# Altium project 无线调试版.PrjPCB
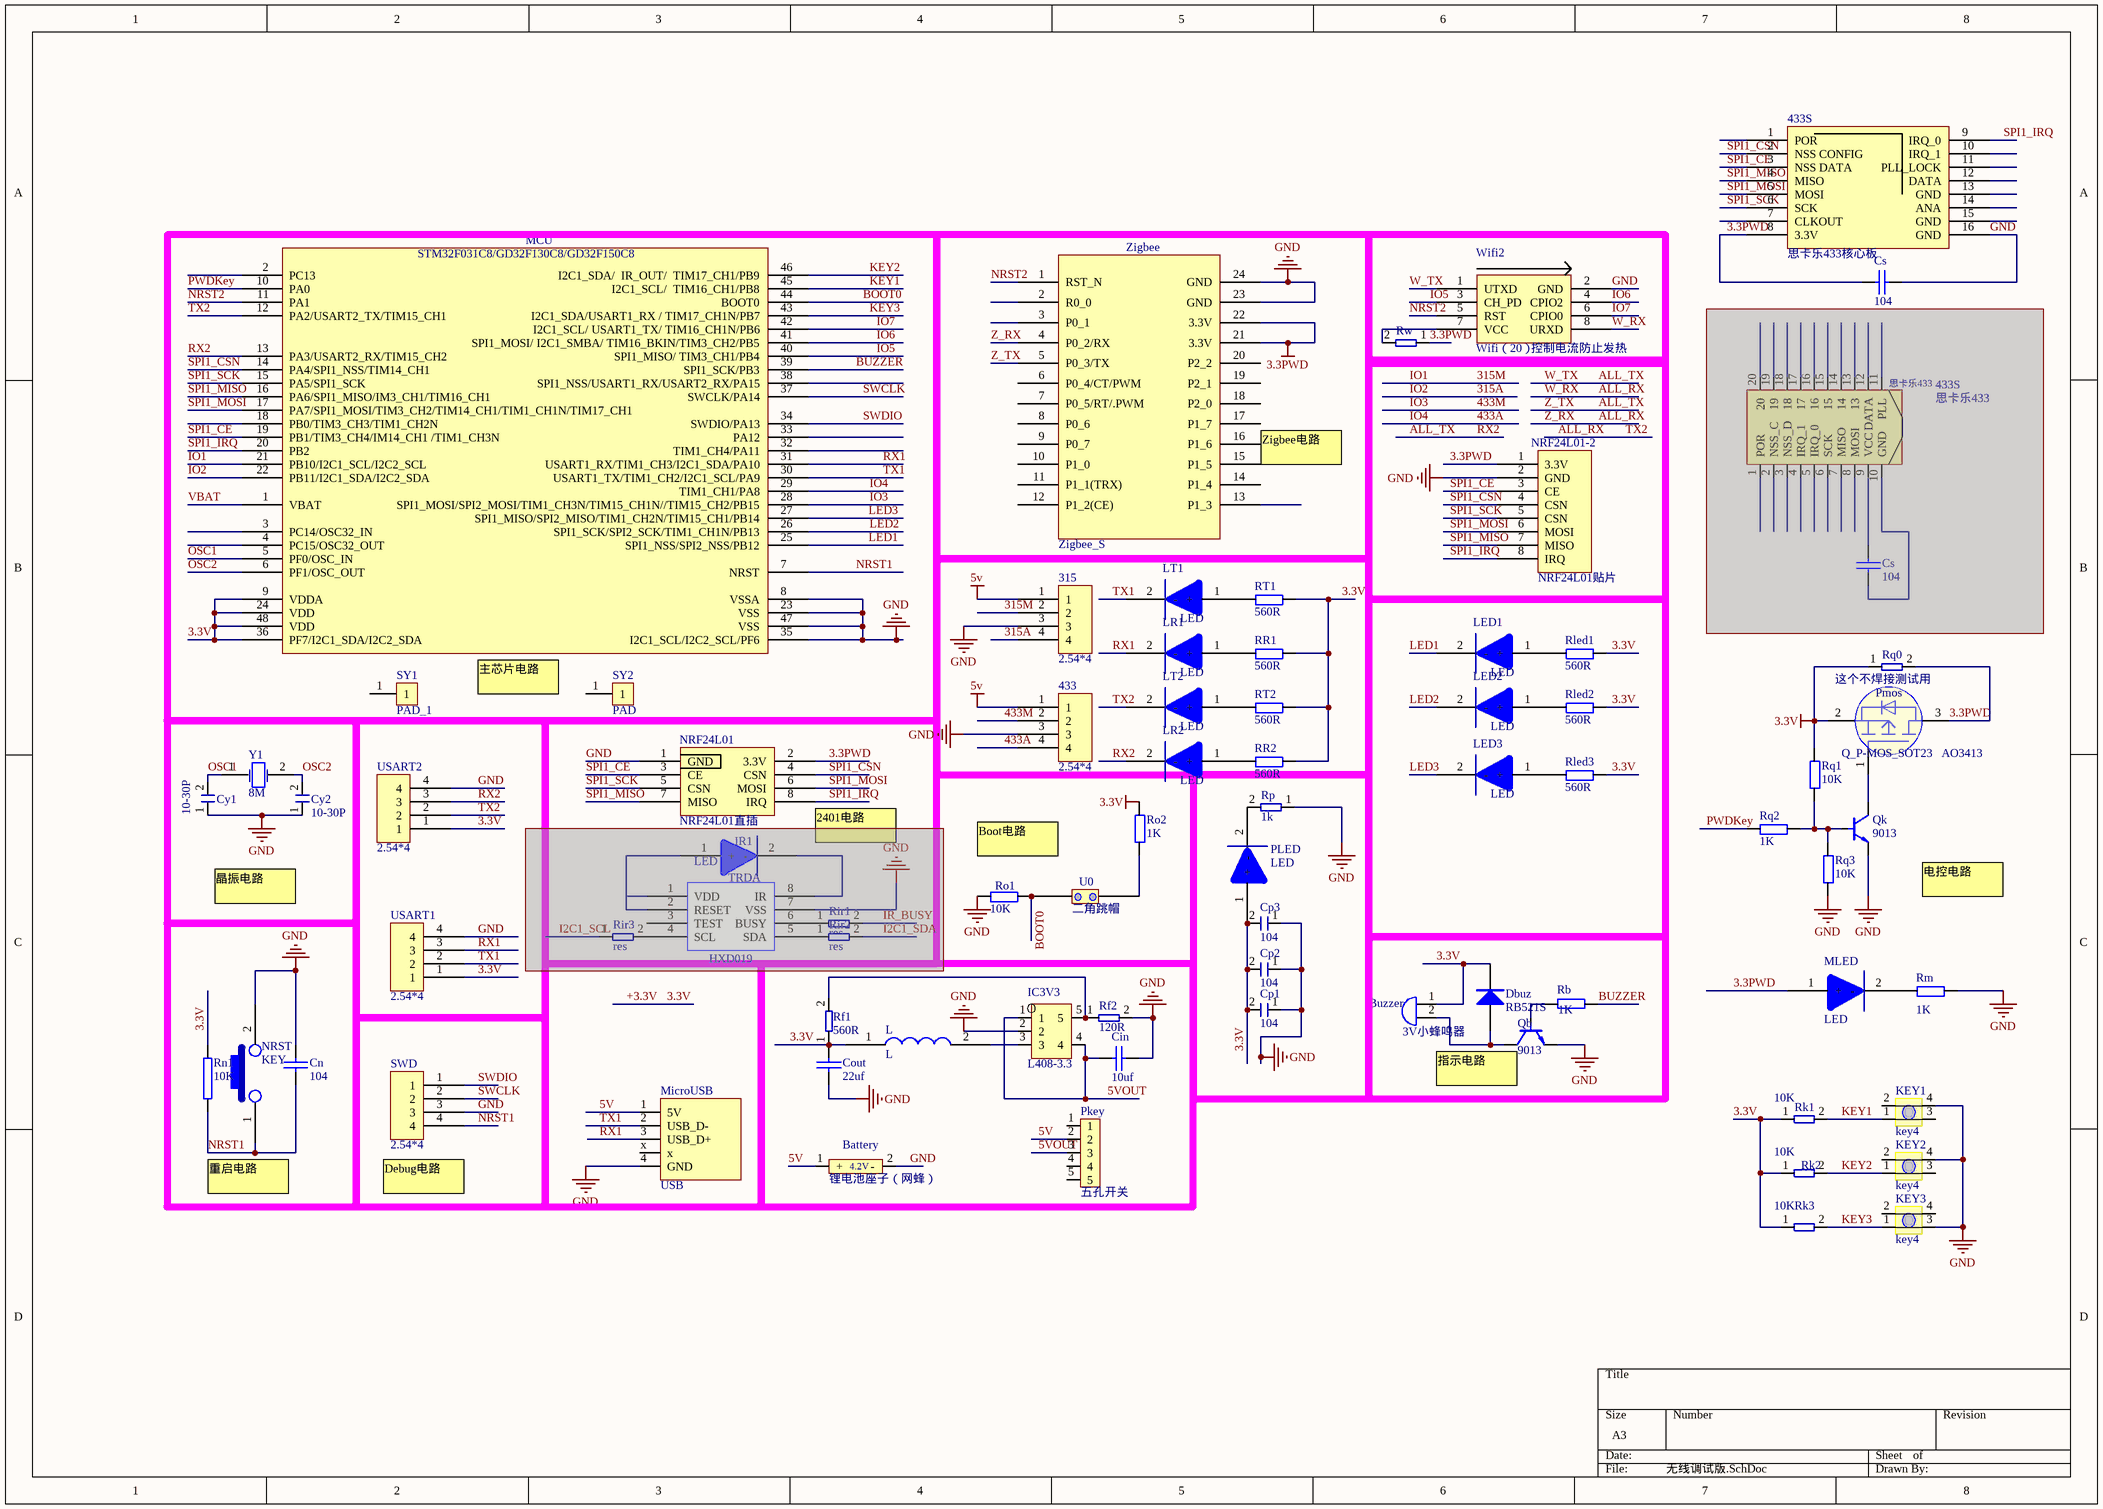
[diagram p0: 无线调试版.SchDoc]
1 sheet, 77 parts. Net scope: global (net labels, ports and power ports of the same name join across sheets).
Board file: 无线调试版.PcbDoc

## Sheet 无线调试版.SchDoc
size A3

### Parts
(Parts that share a designator on the sheet are numbered #1, #2 ... from top to bottom, then left to right.)
315  2.54*4  [2.54*4]
433  2.54*4  [2.54*4]
433S#1  思卡乐433核心板  [思卡乐433核心板]
433S#2  思卡乐433  [思卡乐433]  (masked out: inside a compile mask, not in the netlist)
Battery  锂电池座子（网蜂）  [锂电池插座（网蜂）]
Buzzer  3V小蜂鸣器  [3V小蜂鸣器]
Cin  10uf  [0805]
Cn  104  [0603]
Cout  22uf  [0805]
Cp1  104  [0603]
Cp2  104  [0603]
Cp3  104  [0603]
Cs#1  104  [0603A]
Cs#2  104  [0603A]  (masked out: inside a compile mask, not in the netlist)
Cy1  10-30P  [0603]
Cy2  10-30P  [0603]
Dbuz  RB521S  [贴片二极管]
IC3V3  L408-3.3  [SOT-23-5]
IR1  LED  [LED]  (masked out: inside a compile mask, not in the netlist)
KEY1  key4  [key4]
KEY2  key4  [key4]
KEY3  key4  [key4]
L  L  [774 2.2UH]
LED1  LED  [0805]
LED2  LED  [0805]
LED3  LED  [0805]
LR1  LED  [0805]
LR2  LED  [0805]
LT1  LED  [0805]
LT2  LED  [0805]
MCU  F0-MCU  [STM32F103C8]  (value not drawn)
MicroUSB  USB  [USB_Micro]
MLED  LED  [0805]
NRF24L01  NRF24L01直插  [NFR24L01直插]
NRF24L01-2  NRF24L01贴片  [nrf2401贴片]
NRST  KEY  [KEY]
Pkey  五孔开关  [五孔小开关]
PLED  LED  [0805]
Pmos  Q_P-MOS_SOT23   AO3413  [SOT23]
Qb  9013  [SOT23]
Qk  9013  [SOT23]
Rb  1K  [0603A]
Rf1  560R  [0603A]
Rf2  120R  [0603A]
Rir1  res  [0805]  (masked out: inside a compile mask, not in the netlist)
Rir2  res  [0603A]  (masked out: inside a compile mask, not in the netlist)
Rir3  res  [0603A]  (masked out: inside a compile mask, not in the netlist)
Rk1  10K  [0603A]
Rk2  10K  [0603A]
Rk3  10K  [0603A]
Rled1  560R  [0603A]
Rled2  560R  [0603A]
Rled3  560R  [0603A]
Rm  1K  [0603A]
Rn1  10K  [0603A]
Ro1  10K  [0603A]
Ro2  1K  [0603A]
Rp  1k  [0603A]
Rq0  这个不焊接测试用  [0603A]
Rq1  10K  [0603A]
Rq2  1K  [0603A]
Rq3  10K  [0603A]
RR1  560R  [0603A]
RR2  560R  [0603A]
RT1  560R  [0603A]
RT2  560R  [0603A]
Rw  控制电流防止发热  [0603A]
SWD  2.54*4  [2.54*4]
SY1  PAD_1  [HS]
SY2  PAD  [fc]
TRDA  HXD019  [SOP8]  (masked out: inside a compile mask, not in the netlist)
U0  二角跳帽  [二角跳帽]
USART1  2.54*4  [2.54*4]
USART2  2.54*4  [2.54*4]
Wifi2  Wifi（20）  [Wifi（20）]
Y1  8M  [Crystal]
Zigbee  Zigbee_S  [Zigebee_S]

### Nets
3.3PWD: 433S#1.8(3.3V) Cs#1.1 MLED.1(+) NRF24L01.2(3.3V) NRF24L01-2.1(3.3V) Pmos.3(D) Rq0.2 Rw.1 Zigbee.21(3.3V) Zigbee.22(3.3V)
5V: 315.1 433.1 Battery.1(+) MicroUSB.1(5V) Pkey.2
+3.3V: Buzzer.1(+) Cout.2 Cp1.2 Cp2.2 Cp3.2 Dbuz.K L.1 MCU.9(VDDA) MCU.24(VDD) MCU.36(PF7/I2C1_SDA/I2C2_SDA) MCU.48(VDD) PLED.1(+) Pmos.2(S) Rf1.1 Rk1.1 Rk2.1 Rk3.1 Rled1.2 Rled2.2 Rled3.2 Rn1.1 Ro2.2 Rq0.1 Rq1.2 RR1.2 RR2.2 RT1.2 RT2.2 USART1.1 USART2.1  [also labelled 3.3V]
GND: 315.3 433.3 433S#1.16(GND) Battery.2(-) Cin.2 Cn.2 Cout.1 Cp1.1 Cp2.1 Cp3.1 Cs#1.2 Cy1.1 Cy2.1 IC3V3.2 KEY1.4 KEY2.4 KEY3.3 MCU.8(VSSA) MCU.23(VSS) MCU.35(I2C1_SCL/I2C2_SCL/PF6) MCU.47(VSS) MicroUSB.4(GND) NRF24L01.1(GND) NRF24L01-2.2(GND) NRST.2 Qb.2(e) Qk.2(e) Rf2.2 Rm.2 Ro1.1 Rp.1 Rq3.1 SWD.3 USART1.4 USART2.4 Wifi2.2(GND) Zigbee.23(GND) Zigbee.24(GND)
5VOUT: Cin.1 IC3V3.1 IC3V3.4 Pkey.3
315A: 315.4 MCU.22(PB11/I2C1_SDA/I2C2_SDA)  [also labelled IO2]
315M: 315.2 MCU.21(PB10/I2C1_SCL/I2C2_SCL)  [also labelled IO1]
433A: 433.4 MCU.29(TIM1_CH1/PA8)  [also labelled IO4]
433M: 433.2 MCU.28(SPI1_MOSI/SPI2_MOSI/TIM1_CH3N/TIM15_CH1N//TIM15_CH2/PB15)  [also labelled IO3]
ALL_RX: LT2.2(-) MCU.12(PA2/USART2_TX/TIM15_CH1) USART2.2 Wifi2.8(URXD) Zigbee.4(P0_2/RX)  [also labelled TX2, W_RX, Z_RX]
ALL_TX: LR2.2(-) MCU.13(PA3/USART2_RX/TIM15_CH2) USART2.3 Wifi2.1(UTXD) Zigbee.5(P0_3/TX)  [also labelled RX2, W_TX, Z_TX]
BOOT0: MCU.44(BOOT0) Ro1.2 U0.1
BUZZER: MCU.39(SPI1_SCK/PB3) Rb.1
IO5: MCU.40(SPI1_MISO/_TIM3_CH1/PB4) Wifi2.3(CH_PD)
IO6: MCU.41(SPI1_MOSI/_I2C1_SMBA/_TIM16_BKIN/TIM3_CH2/PB5) Wifi2.4(CPIO2)
IO7: MCU.42(I2C1_SCL/_USART1_TX/_TIM16_CH1N/PB6) Wifi2.6(CPIO0)
KEY1: KEY1.1 MCU.45(I2C1_SCL/__TIM16_CH1/PB8) Rk1.2
KEY2: KEY2.1 MCU.46(I2C1_SDA/__IR_OUT/__TIM17_CH1/PB9) Rk2.2
KEY3: KEY3.1 MCU.43(I2C1_SDA/USART1_RX_/_TIM17_CH1N/PB7) Rk3.2
LED1: LED1.2(-) MCU.25(SPI1_NSS/SPI2_NSS/PB12)
LED2: LED2.2(-) MCU.26(SPI1_SCK/SPI2_SCK/TIM1_CH1N/PB13)
LED3: LED3.2(-) MCU.27(SPI1_MISO/SPI2_MISO/TIM1_CH2N/TIM15_CH1/PB14)
NRST1: Cn.1 MCU.7(NRST) NRST.1 Rn1.2 SWD.4
NRST2: MCU.11(PA1) Wifi2.5(RST) Zigbee.1(RST_N)
OSC1: Cy1.2 MCU.5(PF0/OSC_IN) Y1.1
OSC2: Cy2.2 MCU.6(PF1/OSC_OUT) Y1.2
PWDKey: MCU.10(PA0) Rq2.1
RX1: LR1.2(-) MCU.31(USART1_RX/TIM1_CH3/I2C1_SDA/PA10) MicroUSB.3(USB_D+) USART1.3
SPI1_CE: 433S#1.3(NSS_DATA) MCU.19(PB1/TIM3_CH4/IM14_CH1_/TIM1_CH3N) NRF24L01.3(CE) NRF24L01-2.3(CE)
SPI1_CSN: 433S#1.2(NSS_CONFIG) MCU.14(PA4/SPI1_NSS/TIM14_CH1) NRF24L01.4(CSN) NRF24L01-2.4(CSN)
SPI1_IRQ: 433S#1.9(IRQ_0) MCU.20(PB2) NRF24L01.8(IRQ) NRF24L01-2.8(IRQ)
SPI1_MISO: 433S#1.4(MISO) MCU.16(PA6/SPI1_MISO/IM3_CH1/TIM16_CH1) NRF24L01.7(MISO) NRF24L01-2.7(MISO)
SPI1_MOSI: 433S#1.5(MOSI) MCU.17(PA7/SPI1_MOSI/TIM3_CH2/TIM14_CH1/TIM1_CH1N/TIM17_CH1) NRF24L01.6(MOSI) NRF24L01-2.6(MOSI)
SPI1_SCK: 433S#1.6(SCK) MCU.15(PA5/SPI1_SCK) NRF24L01.5(CSN) NRF24L01-2.5(CSN)
SWCLK: MCU.37(SWCLK/PA14) SWD.2
SWDIO: MCU.34(SWDIO/PA13) SWD.1
TX1: LT1.2(-) MCU.30(USART1_TX/TIM1_CH2/I2C1_SCL/PA9) MicroUSB.2(USB_D-) USART1.2
VBAT: MCU.1(VBAT)
NetBuzzer_2: Buzzer.2(-) Dbuz.A Qb.3(c)
NetIC3V3_3: IC3V3.3 L.2
NetIC3V3_5: IC3V3.5 Rf1.2 Rf2.1
NetLED1_1: LED1.1(+) Rled1.1
NetLED2_1: LED2.1(+) Rled2.1
NetLED3_1: LED3.1(+) Rled3.1
NetLR1_1: LR1.1(+) RR1.1
NetLR2_1: LR2.1(+) RR2.1
NetLT1_1: LT1.1(+) RT1.1
NetLT2_1: LT2.1(+) RT2.1
NetMLED_2: MLED.2(-) Rm.1
NetPLED_2: PLED.2(-) Rp.2
NetPmos_1: Pmos.1(G) Qk.3(c)
NetQb_1: Qb.1(b) Rb.2
NetQk_1: Qk.1(b) Rq1.1 Rq2.2 Rq3.2
NetRo2_1: Ro2.1 U0.2
NetRw_2: Rw.2 Wifi2.7(VCC)

Not connected (* = marked no-connect by the designer): 433S#1 1(POR) 7(CLKOUT) 10(IRQ_1) 11(PLL_LOCK) 12(DATA) 13(GND) 14(ANA) 15(GND); KEY1 2 3; KEY2 2 3; KEY3 2 4; MCU 2(PC13) 3(PC14/OSC32_IN) 4(PC15/OSC32_OUT) 18(PB0/TIM3_CH3/TIM1_CH2N) 32(TIM1_CH4/PA11) 33(PA12) 38(SPI1_NSS/USART1_RX/USART2_RX/PA15); MicroUSB x; Pkey 1 4 5; SY1 1; SY2 1; Zigbee 2(R0_0) 3(P0_1) 6(P0_4/CT/PWM) 7(P0_5/RT/.PWM) 8(P0_6) 9(P0_7) 10(P1_0) 11(P1_1(TRX)) 12(P1_2(CE)) 13(P1_3) 14(P1_4) 15(P1_5) 16(P1_6) 17(P1_7) 18(P2_0) 19(P2_1) 20(P2_2)

### Notes on the sheet
- (near Zigbee) Zigbee电路
- (near MCU) 主芯片电路
- 2401电路
- Boot电路
- 晶振电路
- 电控电路
- (near Qb) 指示电路
- 重启电路
- (near SWD) Debug电路
- (in symbol F0-MCU) STM32F031C8/GD32F130C8/GD32F150C8
- (in symbol 锂电池座子（网蜂）) 4.2V

### Library data of the parts
Cin Cout Cs#1 Cs#2 = CAP: Capacitor
Cn = CAP_1: Capacitor
Cp1-Cp3 Cy1 Cy2 = cap/0805
Pmos = Q_P-MOS_SOT23
Qb Qk = NPN
Rb Ro1 Ro2 = R
Rf1 Rf2 Rk1-Rk3 Rp Rq0 Rw = res
Rled1-Rled3 Rm Rq1-Rq3 RR1 RR2 RT1 RT2 = R_1
Rn1 = RES2
TRDA = HXD091
Y1 = crystal